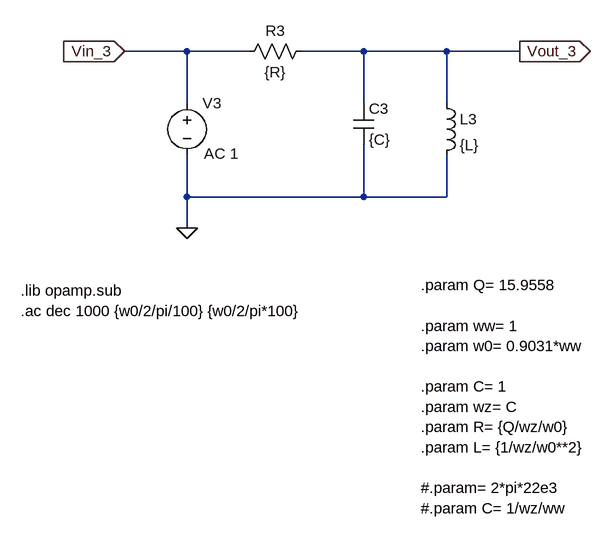
[diagram p0: schematic TS5_LTSpice_Red_Pasiva_SOS_3.asc]
TS5_LTSpice_Red_Pasiva_SOS_3.asc, the LTspice schematic file:
Version 4
SHEET 1 1244 680
WIRE -864 -240 -960 -240
WIRE -768 -240 -864 -240
WIRE -592 -240 -688 -240
WIRE -464 -240 -592 -240
WIRE -352 -240 -464 -240
WIRE -864 -160 -864 -240
WIRE -592 -160 -592 -240
WIRE -464 -160 -464 -240
WIRE -864 -16 -864 -80
WIRE -592 -16 -592 -96
WIRE -592 -16 -864 -16
WIRE -464 -16 -464 -80
WIRE -464 -16 -592 -16
WIRE -864 32 -864 -16
FLAG -864 32 0
FLAG -960 -240 Vin_3
IOPIN -960 -240 In
FLAG -352 -240 Vout_3
IOPIN -352 -240 Out
SYMBOL voltage -864 -176 R0
WINDOW 123 26 93 Left 2
WINDOW 39 0 0 Left 0
SYMATTR Value2 AC 1
SYMATTR InstName V3
SYMATTR Value ""
SYMBOL res -672 -256 R90
WINDOW 0 0 56 VBottom 2
WINDOW 3 32 56 VTop 2
SYMATTR InstName R3
SYMATTR Value {R}
SYMBOL cap -608 -160 R0
SYMATTR InstName C3
SYMATTR Value {C}
SYMBOL ind -480 -176 R0
SYMATTR InstName L3
SYMATTR Value {L}
TEXT -1120 160 Left 2 !.ac dec 1000 {w0/2/pi/100} {w0/2/pi*100}
TEXT -1120 128 Left 2 !.lib opamp.sub
TEXT -504 120 Left 2 !.param Q= 15.9558\n \n.param ww= 1\n.param w0= 0.9031*ww\n \n.param C= 1 \n.param wz= C\n.param R= {Q/wz/w0}\n.param L= {1/wz/w0**2}\n \n#.param= 2*pi*22e3\n#.param C= 1/wz/ww

The netlist it stands for:
* TS5_LTSpice_Red_Pasiva_SOS_3.asc
V3 Vin_3 0 AC 1
R3 Vout_3 Vin_3 {R}
C3 Vout_3 0 {C}
L3 Vout_3 0 {L}
.ac dec 1000 {w0/2/pi/100} {w0/2/pi*100}
.lib opamp.sub
.param Q= 15.9558
.param ww= 1
.param w0= 0.9031*ww
.param C= 1
.param wz= C
.param R= {Q/wz/w0}
.param L= {1/wz/w0**2}
#.param= 2*pi*22e3
#.param C= 1/wz/ww
.backanno
.end

* Results of the author's LTspice run, read from the files saved beside the schematic
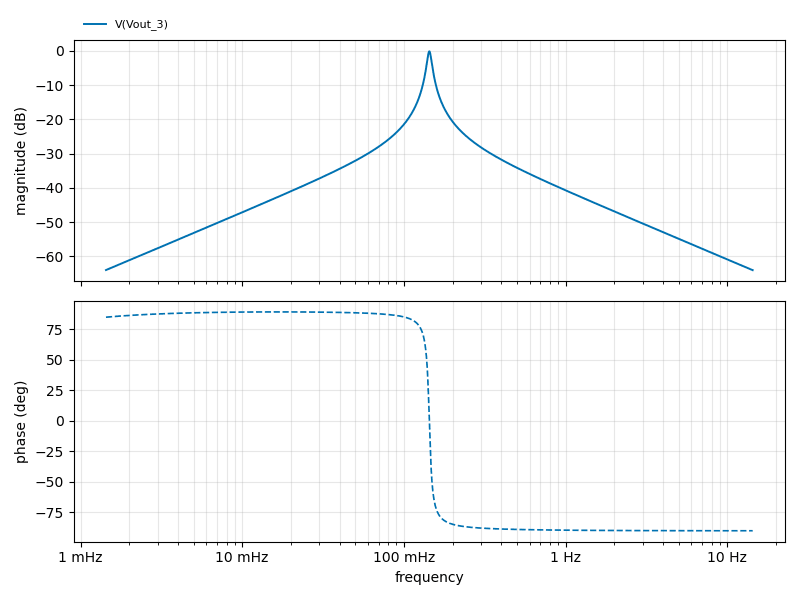
[diagram p1: AC Analysis of TS5_LTSpice_Red_Pasiva_SOS_3.asc, plotted from the saved traces]
* AC Analysis, 1 run:
*   V(Vout_3): -64.02 dB at 1.437 mHz, -64.06 dB at 14.37 Hz, peak -0.12 dB at 143.7 mHz, 3 dB below the peak at 139.2 mHz and 148.4 mHz